# EAGLE schematic BSPD Test Board rev2 (EAGLE 7.7.0)
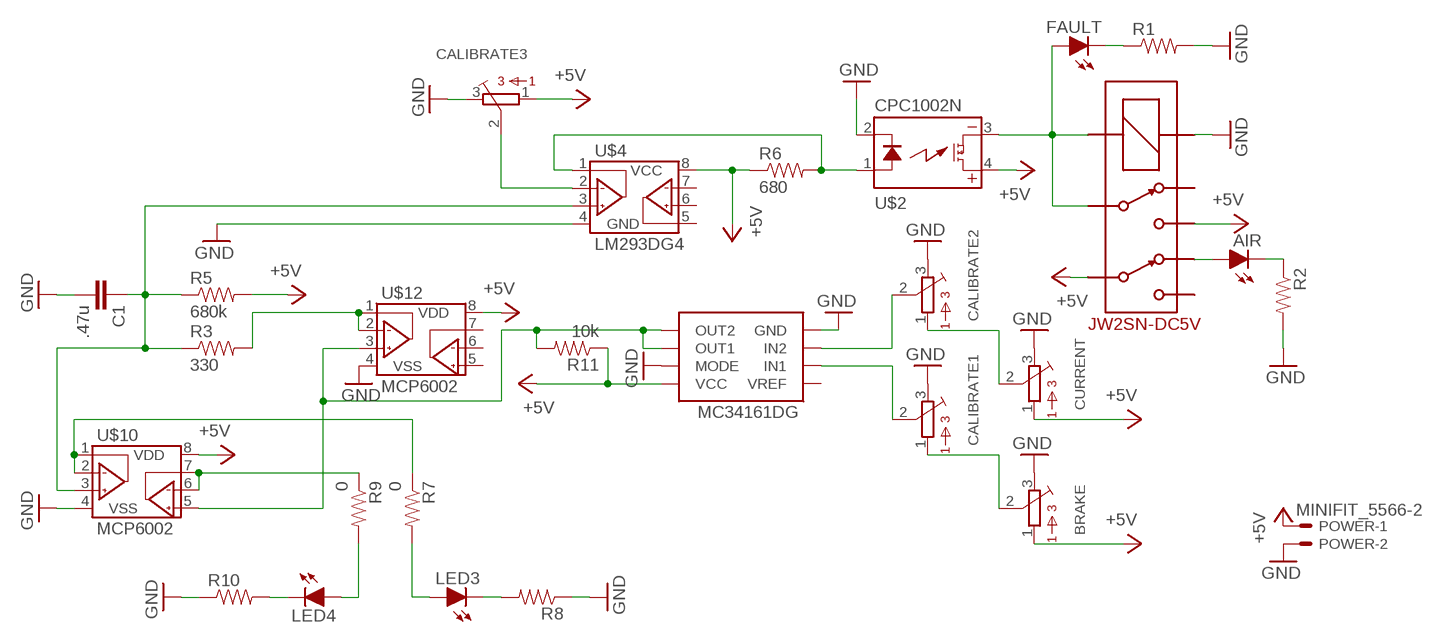
[diagram p0: schematic, sheet 1]

## Parts
AIR  LED-5MM  [LED-5MM]
BRAKE  TRIMPOT_3296C  [TRIMPOT_3296]
C1  .47u  CAPEZ  [CAP-PTH-SMALLEZ]
CALIBRATE1  TRIMPOT_3296C  [TRIMPOT_3296]
CALIBRATE2  TRIMPOT_3296C  [TRIMPOT_3296]
CALIBRATE3  TRIMPOT_3296C  [TRIMPOT_3296]
CURRENT  TRIMPOT_3296C  [TRIMPOT_3296]
FAULT  LED-5MM  [LED-5MM]
LED3  LED-5MM  [LED-5MM]
LED4  LED-5MM  [LED-5MM]
MC34161DG  MC34161DG  [SOIC-08]
POWER  MINIFIT_5566-2  [MINIFIT_5566-2]
R1  RESISTOR0805-RES  [0805]
R2  RESISTOR0805-RES  [0805]
R3  330  RESISTOREZ  [AXIAL-0.3EZ]
R5  680k  RESISTOREZ  [AXIAL-0.3EZ]
R6  680  RESISTOR0805-RES  [0805]
R7  0  RESISTOREZ  [AXIAL-0.3EZ]
R8  RESISTOR0805-RES  [0805]
R9  0  RESISTOREZ  [AXIAL-0.3EZ]
R10  RESISTOR0805-RES  [0805]
R11  10k  RESISTOR0805-RES  [0805]
U$2  CPC1002N  [SOP04]
U$3  DPDT_RELAY_PANASONIC_JW2SN-DC5V  [DPDT_RELAY_PANASONIC_JW2SN]
U$4  LM293DG4  [SOIC-08]
U$10  MCP6002  [SOIC-08]
U$12  MCP6002  [SOIC-08]

## Nets
+5V: BRAKE.1 CALIBRATE3.1 CURRENT.1 MC34161DG.8(VCC) POWER.1 R5.P$2 R6.1 R11.1 U$2.4(DC+) U$3.4 U$3.6 U$4.8(VCC) U$10.8(VDD) U$12.8(VDD)
GND: BRAKE.3 C1.2 CALIBRATE1.3 CALIBRATE2.3 CALIBRATE3.3 CURRENT.3 MC34161DG.4(GND) MC34161DG.7(MODE) POWER.2 R1.2 R2.2 R8.1 R10.1 U$2.2(CONTROL-) U$3.COIL+ U$4.4(GND) U$10.4(VSS) U$12.4(VSS)
N$1: FAULT.A U$2.3(DC-) U$3.3 U$3.COIL-
N$2: AIR.K(C) R2.1
N$3: R3.P$2 U$12.1(VOUTA) U$12.2(VINA-)
N$4: MC34161DG.5(OUT2) MC34161DG.6(OUT1) R11.2 U$10.5(VINB+) U$12.3(VINA+)
N$5: CALIBRATE2.2 MC34161DG.3(IN2)
N$6: CALIBRATE1.2 MC34161DG.2(IN1)
N$7: CALIBRATE3.2 U$4.2(1IN-)
N$8: FAULT.K(C) R1.1
N$9: R6.2 U$2.1(CONTROL+) U$4.1(1OUT)
N$10: LED3.A R7.P$2
N$11: LED3.K(C) R8.2
N$12: LED4.A R9.P$2
N$13: C1.1 R3.P$1 R5.P$1 U$4.3(1IN+) U$10.3(VINA+)
N$14: LED4.K(C) R10.2
N$15: BRAKE.2 CALIBRATE1.1
READ_CHARGE: R7.P$1 U$10.1(VOUTA) U$10.2(VINA-)
READ_IMPED: R9.P$1 U$10.6(VINB-) U$10.7(VOUTB)
SENSE_A: CALIBRATE2.1 CURRENT.2
SHUTDOWN_OUT: AIR.A U$3.7
Unconnected: MC34161DG.1(VREF) U$3.2 U$3.5 U$4.5(2IN+) U$4.6(2IN-) U$4.7(2OUT) U$12.5(VINB+) U$12.6(VINB-) U$12.7(VOUTB)

## Library data of the parts
AIR FAULT LED3 LED4 = HyTechDevices:LED: Light Emitting Diode (LED) Source: Dangerous Prototypes Eagle Library <https://github.com/DangerousPrototypes/Eagle_Part_Library>
BRAKE CALIBRATE1-CALIBRATE3 CURRENT = HyTechDevices:TRIMPOT_3296: 3296 Series 3/8" Square Trimmer Source <https://github.com/chiengineer/Eagle-Libraries/blob/master/Potentiometers/bourns.lbr>
C1 = HyTechDevices:CAP: Capacitor Standard 0603 ceramic capacitor, and 0.1" leaded capacitor.
MC34161DG = HyTechDevices:MC34161DG: ON Semiconductor MC34161 Dual Channel Voltage Monitor
POWER = HyTechDevices:MINIFIT_5566-2: Mini-Fit Junior connector 2 pole Source: http://www.molex.com; OC_FARNELL: 1822072; OC_NEWARK: unknown
R1-R3 R5-R11 = HyTechDevices:RESISTOR: Resistor Basic schematic elements and footprints for 0603, 1206, and PTH resistors.
U$2 = HyTechDevices:CPC1002N: IXYS Solid State Relay .7A
U$3 = HyTechDevices:DPDT_RELAY_PANASONIC_JW2SN-DC5V: Double Pull Double Throw Relay 5VDC Datasheet <http://www.mouser.com/ds/2/316/jw-catalog-461998.pdf> Product Page <http://www.mouser.com/ProductDetail/Panasonic-Industrial-Devices/JW2SN-DC5V>
U$4 = HyTechDevices:LM293: Texas Instruments LM293 Dual Differential Comparator
U$10 U$12 = HyTechDevices:MCP6002: Microchip MCP6002 Dual Channel Op Amp